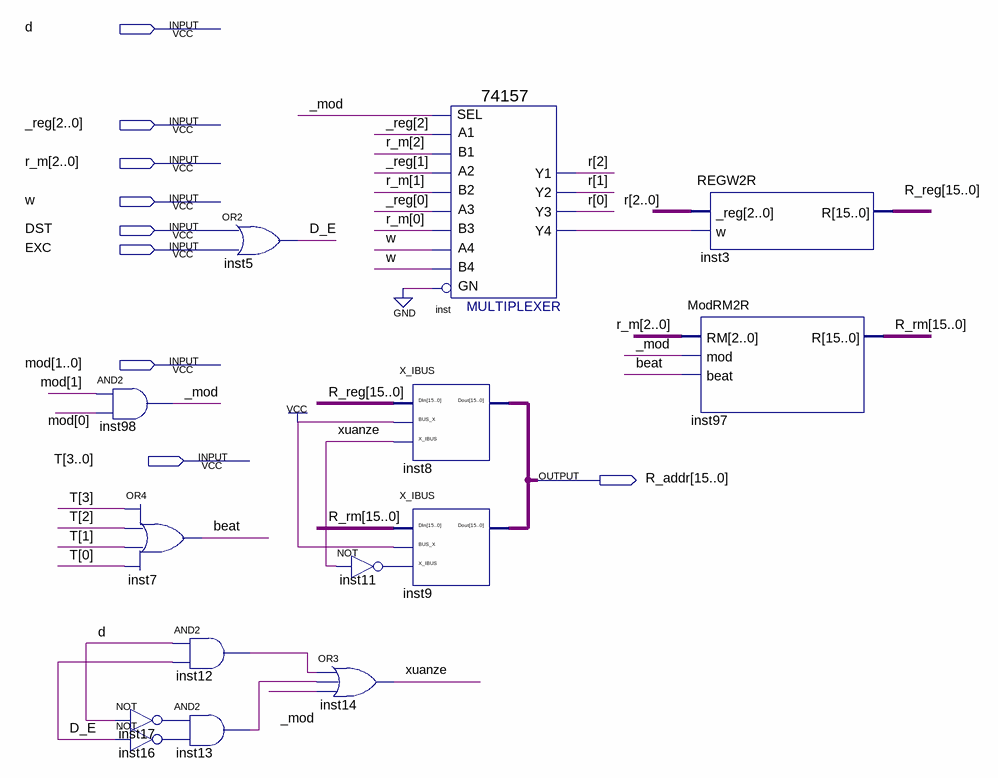
[diagram p0: schematic sheet]
// Quartus schematic R_adrr.bdf as structural Verilog: 14 symbols, 9 pins
module R_adrr (
  input  d,
  input  [2:0] _reg,
  input  [2:0] r_m,
  input  w,
  input  DST,
  input  EXC,
  input  [1:0] mod,
  input  [3:0] T,
  output [15:0] R_addr
);

  wire _mod, beat, D_E, inst11_out, inst12_out, inst13_out, inst16_out, inst17_out, inst_y4, xuanze;
  wire [2:0] r;
  wire [15:0] R_reg, R_rm;

  and inst98 (_mod, mod[1], mod[0]);
  or inst7 (beat, T[3], T[2], T[1], T[0]);
  not inst17 (inst17_out, d);
  not inst16 (inst16_out, D_E);
  or inst5 (D_E, DST, EXC);
  and inst12 (inst12_out, d, D_E);
  and inst13 (inst13_out, inst17_out, inst16_out);
  or inst14 (xuanze, inst12_out, inst13_out, _mod);
  X_IBUS inst8 (.DIn(R_reg), .BUS_X(1'b1), .X_IBUS(xuanze), .Dout(R_addr));
  X_IBUS inst9 (.DIn(R_rm), .BUS_X(1'b1), .X_IBUS(inst11_out), .Dout(R_addr));
  not inst11 (inst11_out, xuanze);
  \74157  inst (
    .A1(_reg[2]), .B1(r_m[2]), .SEL(_mod), .B2(r_m[1]), .A3(_reg[0]), .B3(r_m[0]), .A2(_reg[1]), .B4(w),
    .GN(1'b0), .A4(w), .Y2(r[1]), .Y1(r[2]), .Y4(inst_y4), .Y3(r[0]));
  REGW2R inst3 (._reg(r), .w(inst_y4), .R(R_reg));
  ModRM2R inst97 (.RM(r_m), .mod(_mod), .beat(beat), .R(R_rm));
endmodule
